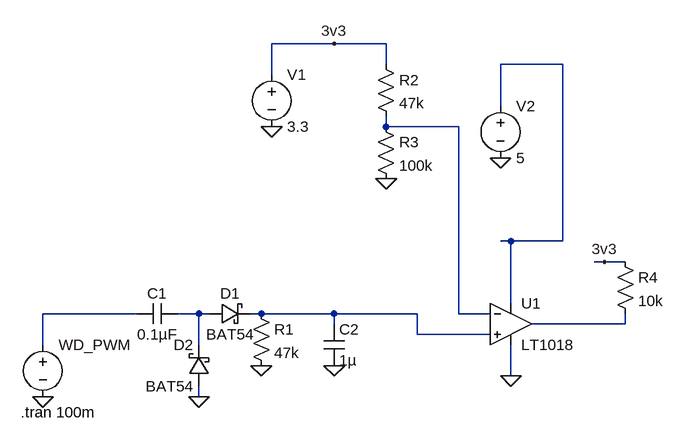
[diagram p0: schematic charge-pump.asc]
charge-pump.asc, the LTspice schematic file:
Version 4
SHEET 1 980 680
WIRE 464 -368 368 -368
WIRE 544 -368 464 -368
WIRE 544 -336 544 -368
WIRE 816 -336 720 -336
WIRE 368 -320 368 -368
WIRE 720 -272 720 -336
WIRE 544 -240 544 -256
WIRE 656 -240 544 -240
WIRE 736 -64 720 -64
WIRE 816 -64 816 -336
WIRE 816 -64 736 -64
WIRE 880 -32 864 -32
WIRE 912 -32 880 -32
WIRE 736 32 736 -64
WIRE 160 48 16 48
WIRE 256 48 224 48
WIRE 272 48 256 48
WIRE 352 48 336 48
WIRE 464 48 352 48
WIRE 592 48 464 48
WIRE 656 48 656 -240
WIRE 704 48 656 48
WIRE 464 64 464 48
WIRE 912 64 912 48
WIRE 912 64 768 64
WIRE 592 80 592 48
WIRE 704 80 592 80
WIRE 16 96 16 48
WIRE 256 96 256 48
WIRE 736 144 736 96
WIRE 256 176 256 160
FLAG 16 176 0
FLAG 352 128 0
FLAG 256 176 0
FLAG 464 128 0
FLAG 368 -240 0
FLAG 544 -160 0
FLAG 720 -192 0
FLAG 736 144 0
FLAG 464 -368 3v3
FLAG 880 -32 3v3
SYMBOL voltage 16 80 R0
WINDOW 3 24 96 Invisible 2
WINDOW 123 0 0 Left 0
WINDOW 39 0 0 Left 0
SYMATTR InstName WD_PWM
SYMATTR Value PULSE(0 3.3 0 10n 10n 500u 1000u 50)
SYMBOL cap 224 32 R90
WINDOW 0 0 32 VBottom 2
WINDOW 3 32 32 VTop 2
SYMATTR InstName C1
SYMATTR Value 0.1µF
SYMBOL res 336 32 R0
SYMATTR InstName R1
SYMATTR Value 47k
SYMBOL schottky 272 64 R270
WINDOW 0 32 32 VTop 2
WINDOW 3 0 32 VBottom 2
SYMATTR InstName D1
SYMATTR Value BAT54
SYMATTR Description Diode
SYMATTR Type diode
SYMBOL schottky 272 160 R180
WINDOW 0 24 64 Left 2
WINDOW 3 24 0 Left 2
SYMATTR InstName D2
SYMATTR Value BAT54
SYMATTR Description Diode
SYMATTR Type diode
SYMBOL cap 448 64 R0
SYMATTR InstName C2
SYMATTR Value 1µ
SYMBOL Comparators\\LT1018 736 64 R0
SYMATTR InstName U1
SYMBOL voltage 368 -336 R0
WINDOW 123 0 0 Left 0
WINDOW 39 0 0 Left 0
SYMATTR InstName V1
SYMATTR Value 3.3
SYMBOL res 528 -352 R0
SYMATTR InstName R2
SYMATTR Value 47k
SYMBOL res 528 -256 R0
SYMATTR InstName R3
SYMATTR Value 100k
SYMBOL voltage 720 -288 R0
WINDOW 123 0 0 Left 0
WINDOW 39 0 0 Left 0
SYMATTR InstName V2
SYMATTR Value 5
SYMBOL res 896 -48 R0
SYMATTR InstName R4
SYMATTR Value 10k
TEXT -18 200 Left 2 !.tran 100m

The netlist it stands for:
* charge-pump.asc
V§WD_PWM N003 0 PULSE(0 3.3 0 10n 10n 500u 1000u 50)
C1 N004 N003 0.1µF
R1 N005 0 47k
D1 N004 N005 BAT54
D2 0 N004 BAT54
C2 N005 0 1µ
XU1 N005 N002 N001 0 N006 LT1018  ; pins In+ In- V+ V- OUT
V1 3v3 0 3.3
R2 3v3 N002 47k
R3 N002 0 100k
V2 N001 0 5
R4 3v3 N006 10k
.model D D
.lib standard.dio
.tran 100m
.lib LTC1.lib
.backanno
.end